# EAGLE design Spiderbot (EAGLE 5.11)
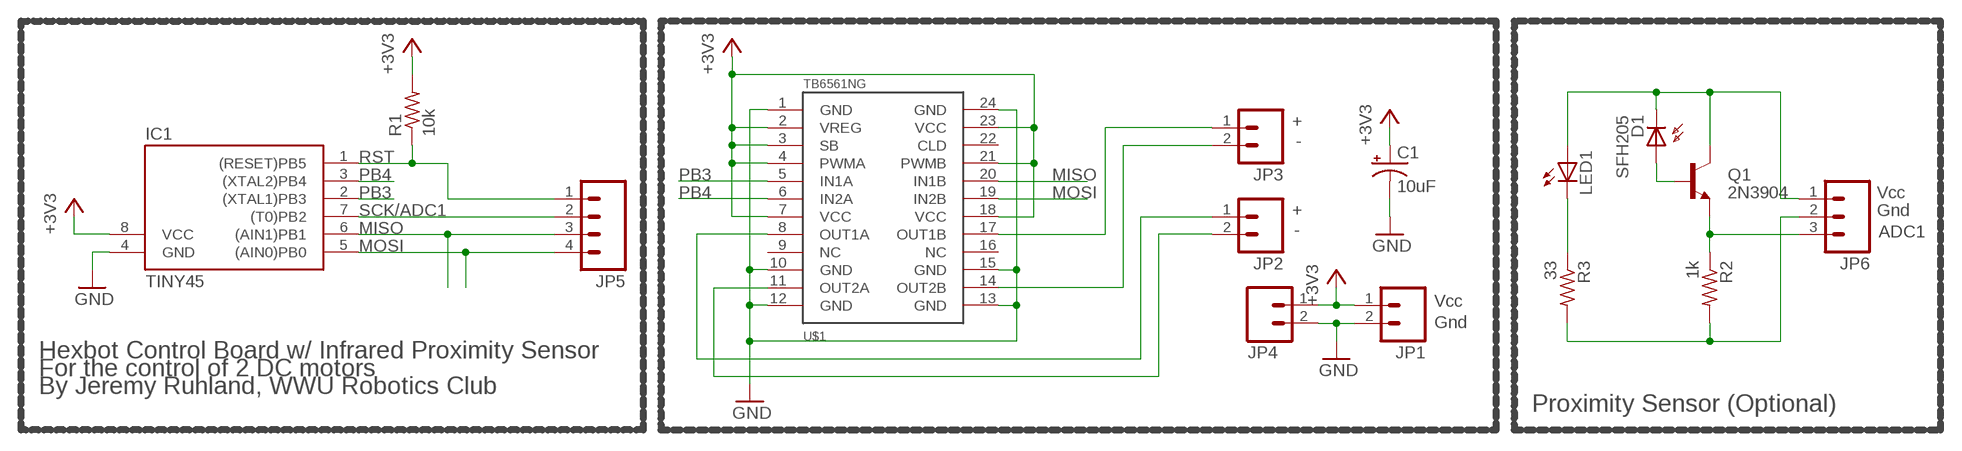
[diagram p0: schematic, sheet 1]

## Parts
C1  10uF  CAP_POLPTH2  [CPOL-RADIAL-10UF-25V]
D1  SFH205  [SFH205]
IC1  TINY45  TINY10P  [DIL08]
JP1  M02PTH  [1X02]
JP2  M02PTH  [1X02]
JP3  M02PTH  [1X02]
JP4  M02PTH  [1X02]
JP5  M04PTH  [1X04]
JP6  M03PTH  [1X03]
LED1  LED5MM  [LED5MM]
Q1  2N3904  TRANSISTOR_NPNTO-92-AMMO  [TO-92-AMMO]
R1  10k  R-US_0204/2V  [0204V]
R2  1k  R-US_0204/2V  [0204V]
R3  33  R-US_0204/2V  [0204V]
U$1  TB6561NG  [DIL24-3]

## Nets
+3V3: C1.1(+) IC1.8(VCC) JP1.1 JP4.1 R1.2 U$1.2(VREG) U$1.3(SB) U$1.4(PWMA) U$1.7(VCC) U$1.18(VCC) U$1.21(PWMB) U$1.23(VCC)
GND: C1.2(-) IC1.4(GND) JP1.2 JP4.2 U$1.1(GND) U$1.10(GND) U$1.12(GND) U$1.13(GND) U$1.15(GND) U$1.24(GND)
MISO: IC1.6((AIN1)PB1) JP5.3 U$1.20(IN1B)
MOSI: IC1.5((AIN0)PB0) JP5.4 U$1.19(IN2B)
N$5: JP3.1 U$1.17(OUT1B)
N$7: JP3.2 U$1.14(OUT2B)
N$8: JP2.1 U$1.8(OUT1A)
N$9: JP2.2 U$1.11(OUT2A)
N$12: D1.K(C) JP6.1 LED1.A Q1.3(C)
N$13: D1.A Q1.2(B)
N$14: JP6.3 Q1.1(E) R2.1
N$15: JP6.2 R2.2 R3.2
N$16: LED1.K(C) R3.1
PB3: IC1.2((XTAL1)PB3) U$1.5(IN1A)
PB4: IC1.3((XTAL2)PB4) U$1.6(IN2A)
RST: IC1.1((RESET)PB5) JP5.1 R1.1
SCK/ADC1: IC1.7((T0)PB2) JP5.2
Unconnected: U$1.9(NC) U$1.16(NC) U$1.22(CLD)

## Notes on the sheet
- +
- -
- Vcc
- + | Gnd
- - | ADC1
- Vcc
- Gnd
- Hexbot Control Board w/ Infrared Proximity Sensor
- For the control of 2 DC motors
- By Jeremy Ruhland, WWU Robotics Club
- Proximity Sensor (Optional)

## Library data of the parts
C1 = sparkfun:CAP_POL: Capacitor Polarized These are standard SMD and PTH capacitors. Normally 10uF, 47uF, and 100uF in electrolytic and tantalum varieties. Always verify the external diameter of the through hole cap, it varies with capacity, voltage, and manufacturer. The EIA devices should be standard.
D1 = opto-trans-siemens:SFH205: PHOTO DIODE; OC_FARNELL: unknown; OC_NEWARK: unknown
IC1 = atmel:TINY10: MICROCONTROLLER 1 Kbytes ROM; OC_FARNELL: unknown; OC_NEWARK: unknown
JP1-JP4 = sparkfun:M02: Header 2 Standard 2-pin 0.1" header. Use with straight break away headers (SKU : PRT-00116), right angle break away headers (PRT-00553), swiss pins (PRT-00743), machine pins (PRT-00117), and female headers (PRT-00115). Molex polarized connector foot print use with SKU : PRT-08233 with associated crimp pins and housings.
JP5 = sparkfun:M04: Header 4 Standard 4-pin 0.1" header. Use with straight break away headers (SKU : PRT-00116), right angle break away headers (PRT-00553), swiss pins (PRT-00743), machine pins (PRT-00117), and female headers (PRT-00115). Molex polarized connector foot print use with SKU : PRT-08231 with associated crimp pins and housings. 1MM SMD Version SKU: PRT-10208
JP6 = sparkfun:M03: Header 3 Standard 3-pin 0.1" header. Use with straight break away headers (SKU : PRT-00116), right angle break away headers (PRT-00553), swiss pins (PRT-00743), machine pins (PRT-00117), and female headers (PRT-00115). Molex polarized connector foot print use with SKU : PRT-08232 with associated crimp pins and housings.
LED1 = led:LED: LED OSRAM: - CHIPLED LG R971, LG N971, LY N971, LG Q971, LY Q971, LO R971, LY R971 LH N974, LH R974 LS Q976, LO Q976, LY Q976 LO Q996 - Hyper CHIPLED LW Q18S LB Q993, LB Q99A, LB R99A - SideLED LS A670, LO A670, LY A670, LG A670, LP A670 LB A673, LV A673, LT A673, LW A673 LH A674 LY A675 LS A676, LA A676, LO A676, LY A676, LW A676 LS A679, LY A679, LG A679 - Hyper Micro SIDELED® LS Y876, LA Y876, LO Y876, LY Y876 LT Y87S - SmartLED LW L88C, LW L88S LB L89C, LB L89S, LG L890 LS L89K, LO L89K, LY L89K LS L896, LA L896, LO L896, LY L896 - TOPLED LS T670, LO T670, LY T670, LG T670, LP T670 LSG T670, LSP T670, LSY T670, LOP T670, LYG T670 LG T671, LOG T671, LSG T671 LB T673, LV T673, LT T673, LW T673 LH T674 LS T676, LA T676, LO T676, LY T676, LB T676, LH T676, LSB T676, LW T676 LB T67C, LV T67C, LT T67C, LS T67K, LO T67K, LY T67K, LW E67C LS E67B, LA E67B, LO E67B, LY E67B, LB E67C, LV E67C, LT E67C LW T67C LS T679, LY T679, LG T679 LS T770, LO T770, LY T770, LG T770, LP T770 LB T773, LV T773, LT T773, LW T773 LH T774 LS E675, LA E675, LY E675, LS T675 LS T776, LA T776, LO T776, LY T776, LB T776 LHGB T686 LT T68C, LB T68C - Hyper Mini TOPLED® LB M676 - Mini TOPLED Santana® LG M470 LS M47K, LO M47K, LY M47K Source: http://www.osram.convergy.de LUXEON: - LUMILED® LXK2-PW12-R00, LXK2-PW12-S00, LXK2-PW14-U00, LXK2-PW14-V00 LXK2-PM12-R00, LXK2-PM12-S00, LXK2-PM14-U00 LXK2-PE12-Q00, LXK2-PE12-R00, LXK2-PE12-S00, LXK2-PE14-T00, LXK2-PE14-U00 LXK2-PB12-K00, LXK2-PB12-L00, LXK2-PB12-M00, LXK2-PB14-N00, LXK2-PB14-P00, LXK2-PB14-Q00 LXK2-PR12-L00, LXK2-PR12-M00, LXK2-PR14-Q00, LXK2-PR14-R00 LXK2-PD12-Q00, LXK2-PD12-R00, LXK2-PD12-S00 LXK2-PH12-R00, LXK2-PH12-S00 LXK2-PL12-P00, LXK2-PL12-Q00, LXK2-PL12-R00 Source: www.luxeon.com KINGBRIGHT: KA-3528ASYC Source: www.kingbright.com
Q1 = sparkfun:TRANSISTOR_NPN: Transistor NPN BJT configuration in SOT23 package. MMBT2222 is the common NPN we use. Double check BCE configuration again layout.
R1-R3 = resistor:R-US_: RESISTOR, American symbol
U$1 = TB6561NG:TB6561NG

## Board
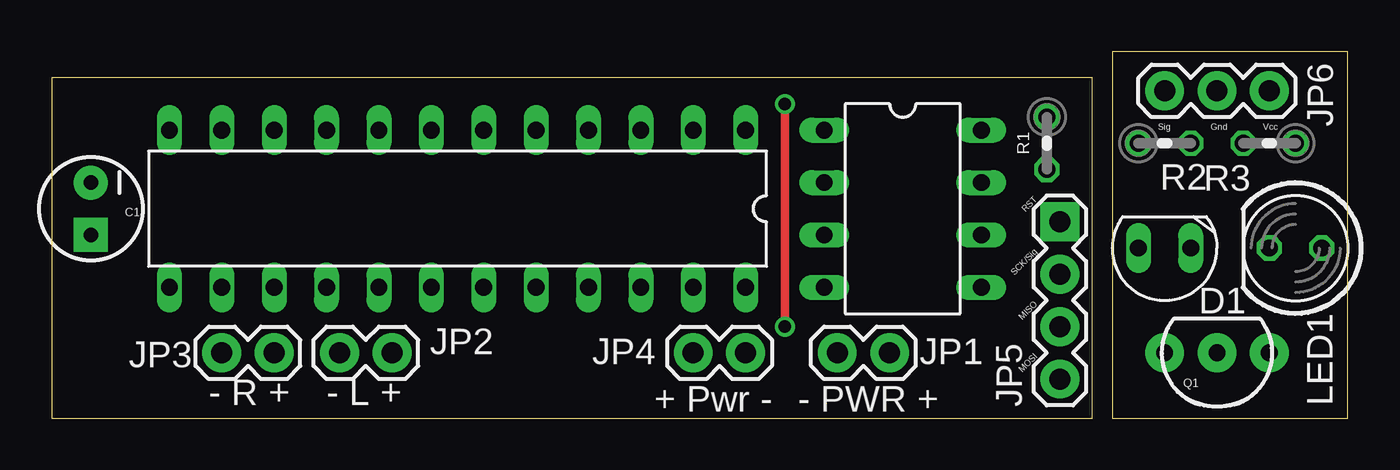
[diagram p1: board, top side]
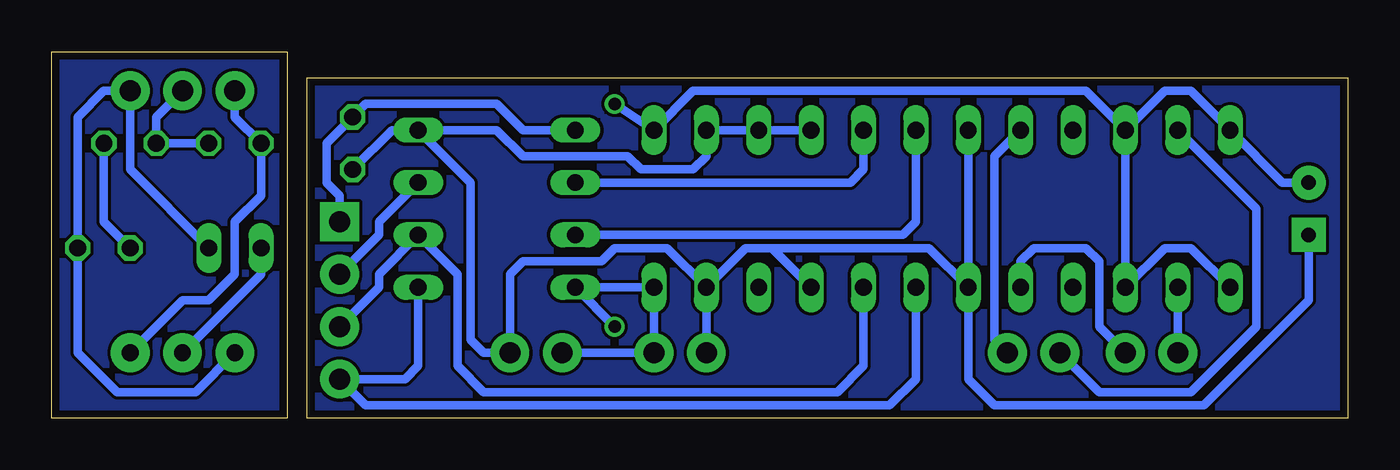
[diagram p2: board, bottom side, seen from below]

Size 62.87 x 17.78 mm. Coordinates in mm from the lower left corner, seen from the top.
Outline: 0,0 50.47,0 50.47,16.5 0,16.5 0,0
Outline: 62.87,17.78 51.44,17.78 51.44,0 62.87,0 62.87,17.78
Copper layers (1*16): Top 0.0356mm / dielectric 1.5011mm / Bottom 0.0356mm
Design rules "Dorkbot_PCBOrder": minimum track width 6mil, minimum drill 13mil, track to track 6mil, track to pad 6mil, pad to pad 6mil, via to via 6mil, smd to smd 6mil, copper to edge 15mil, drill to drill 6mil, minimum pad ring 7mil, minimum via ring 7mil, stop-mask expansion 4mil, vias tented up to drill 0mil, thermal gap 10mil

### Footprints (pad centres in the part's own frame; a part is rotated, then mirrored left to right if it is on the bottom)
CPOL-RADIAL-10UF-25V = drill 0.7 pad 1.651 square: 1 1.27,0 | drill 0.7 pad 1.651 round: 2 -1.27,0
SFH205 = drill 0.813 long: A 0,-1.27; K 0,1.27
DIL08 = drill 0.813 long: 1 -3.81,-3.81; 2 -1.27,-3.81; 3 1.27,-3.81; 4 3.81,-3.81; 5 3.81,3.81; 6 1.27,3.81; 7 -1.27,3.81; 8 -3.81,3.81
1X02 = drill 1.016 pad 1.88 round: 1 0,0; 2 2.54,0
1X04 = drill 1.016 pad 1.88 square: 1 0,0 | drill 1.016 pad 1.88 round: 2 2.54,0; 3 5.08,0; 4 7.62,0
1X03 = drill 1.016 pad 1.88 round: 1 0,0; 2 2.54,0; 3 5.08,0
LED5MM = drill 0.813 octagon: A -1.27,0; K 1.27,0
TO-92-AMMO = drill 0.813 pad 1.88 round: 1 -2.54,0; 2 0,0; 3 2.54,0
0204V = drill 0.813 octagon: 1 -1.27,0; 2 1.27,0
DIL24-3 = drill 0.813 long: 1 -13.97,-3.81; 2 -11.43,-3.81; 3 -8.89,-3.81; 4 -6.35,-3.81; 5 -3.81,-3.81; 6 -1.27,-3.81; 7 1.27,-3.81; 8 3.81,-3.81; 9 6.35,-3.81; 10 8.89,-3.81; 11 11.43,-3.81; 12 13.97,-3.81; 13 13.97,3.81; 14 11.43,3.81; 15 8.89,3.81; 16 6.35,3.81; 17 3.81,3.81; 18 1.27,3.81; 19 -1.27,3.81; 20 -3.81,3.81; 21 -6.35,3.81; 22 -8.89,3.81; 23 -11.43,3.81; 24 -13.97,3.81

### Placement (x,y rotation side)
C1  1.91,10.16 270 top
D1  53.98,8.26 270 top
IC1  41.27,10.16 270 top
JP1  40.64,3.17 180 top
JP2  16.51,3.17 180 top
JP3  10.79,3.17 180 top
JP4  31.11,3.17 0 top
JP5  48.9,9.53 270 top
JP6  59.05,15.88 180 top
LED1  60.33,8.26 180 top
Q1  56.52,3.17 180 top
R1  48.26,13.34 270 top
R2  53.98,13.34 0 top
R3  59.05,13.34 180 top
U$1  19.68,10.16 180 top

### Tracks (layer width: path | path; a pad name or v marks a point on that pad's centre or on a via)
+3V3
  Bottom 0.406: U$1.23 29.21,8.26 27.94,8.26 | 27.94,8.26 20.32,8.26 U$1.18 | 27.94,8.26 U$1.21 | U$1.4 U$1.3 U$1.2 31.11,12.7 31.75,12.06 34.29,12.06 34.92,12.7 40.01,12.7 41.27,13.97 IC1.8 | U$1.23 JP4.1 | U$1.23 33.02,8.26 35.56,8.26 36.2,7.62 40.01,7.62 40.64,6.99 JP1.1 41.91,3.17 42.55,3.81 42.55,11.43 IC1.8 | U$1.18 U$1.7 | C1.1 1.91,5.71 6.99,0.64 17.14,0.64 18.41,1.91 U$1.18 | IC1.8 46.35,13.97 R1.2
GND  (via drill 0.6)
  Top 0.406: v35.56,15.24 v35.56,4.45
  Bottom 0.406: U$1.13 7.62,8.26 8.89,8.26 U$1.15 U$1.10 | v35.56,15.24 U$1.1 31.75,15.88 12.7,15.88 U$1.10 | C1.2 3.17,11.43 U$1.12 7.62,15.88 8.89,15.88 U$1.10 | JP1.2 JP4.2 U$1.24 IC1.4 v35.56,4.45
MISO
  Bottom 0.406: U$1.20 23.5,2.54 24.77,1.27 41.91,1.27 43.18,2.54 43.18,6.99 IC1.6 46.99,6.99 46.99,6.35 JP5.3
MOSI
  Bottom 0.406: U$1.19 20.95,1.91 22.23,0.64 47.62,0.64 JP5.4 45.72,1.91 45.09,2.54 IC1.5
N$2
  pour Bottom: 0,16.51 50.8,16.51 50.8,0 0,0
N$5
  Bottom 0.406: U$1.17 15.88,7.62 15.24,8.26 12.7,8.26 12.06,7.62 12.06,4.45 JP3.1
N$7
  Bottom 0.406: JP3.2 U$1.14
N$8
  Bottom 0.406: JP2.1 17.14,3.81 17.14,12.7 U$1.8
N$9
  Bottom 0.406: JP2.2 12.06,1.27 7.62,1.27 4.45,4.45 4.45,10.16 U$1.11
N$12
  Bottom 0.406: D1.K 59.05,12.06 JP6.1 60.33,15.88 61.59,14.61 LED1.A 61.59,3.17 59.69,1.27 55.88,1.27 Q1.3
N$13
  Bottom 0.406: D1.A 52.7,6.99 Q1.2
N$14
  Bottom 0.406: JP6.3 53.98,14.61 R2.1 52.7,10.79 53.98,9.53 53.98,6.99 55.24,5.71 56.52,5.71 Q1.1
N$15
  Bottom 0.406: R2.2 R3.2 57.78,14.61 JP6.2
N$16
  Bottom 0.406: R3.1 60.33,9.53 LED1.K
N$17
  pour Bottom: 51.44,17.78 62.87,17.78 62.87,0 51.44,0
PB3
  Bottom 0.406: U$1.5 23.5,12.06 24.13,11.43 IC1.2
PB4
  Bottom 0.406: U$1.6 20.95,9.53 21.59,8.89 IC1.3
RST
  Bottom 0.406: IC1.1 40.01,13.97 41.27,15.24 47.62,15.24 R1.1 49.53,13.34 49.53,11.43 48.9,10.79 JP5.1
SCK/ADC1
  Bottom 0.406: JP5.2 46.99,8.89 46.99,9.53 IC1.7

### Text on the board
_tsilk: Sig | Gnd | Vcc | RST | SCK/Sig | MISO | MOSI | - R + | - L + | + Pwr - | - PWR +